# Altium schematic sheet Top.SchDoc
size A4; DocumentNumber: 1; SheetNumber: 1; SheetTotal: 7
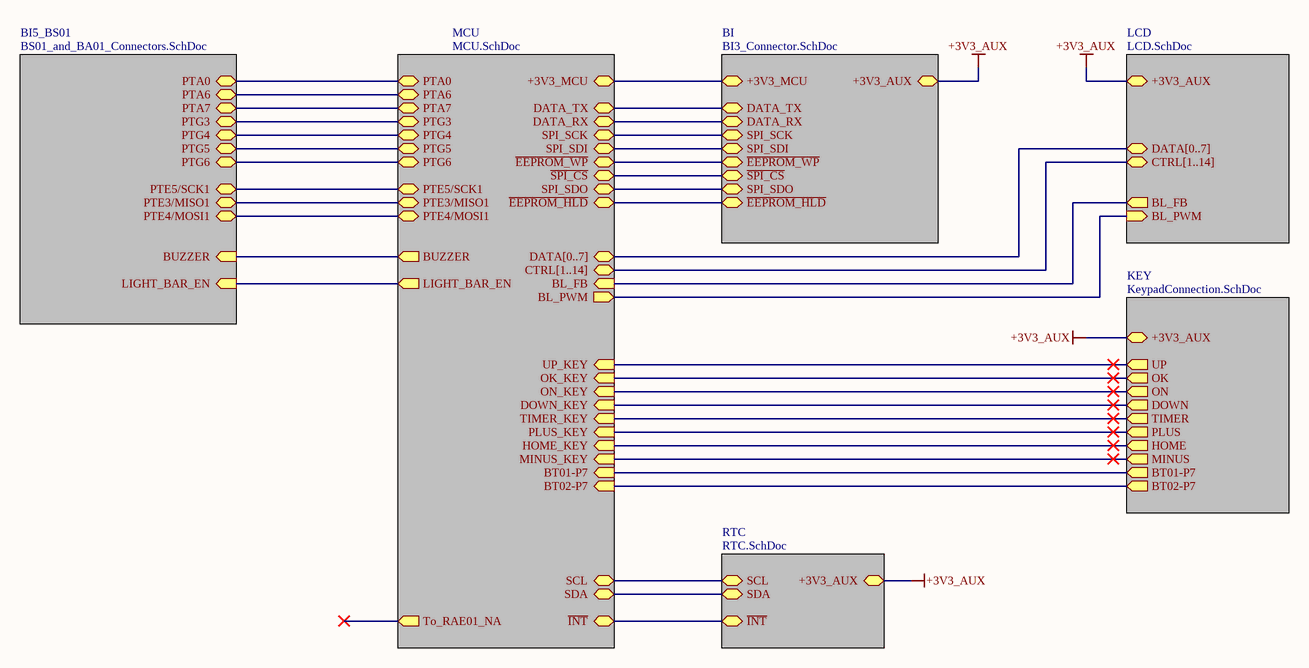
[diagram p0: Top.SchDoc]

## Sub-sheets
BI = BI3_Connector.SchDoc: DATA_TX, +3V3_MCU, +3V3_AUX, DATA_RX, SPI_SCK, SPI_SDI, ~{EEPROM_WP}, ~{SPI_CS}, SPI_SDO, ~{EEPROM_HLD}
BI5_BS01 = BS01_and_BA01_Connectors.SchDoc: PTA6 (bidir), PTA7 (bidir), PTG3 (bidir), PTG4 (bidir), PTG5 (bidir), PTG6 (bidir), PTE5/SCK1 (bidir), PTE3/MISO1 (bidir), PTE4/MOSI1 (bidir), PTA0 (bidir), LIGHT_BAR_EN (in), BUZZER (in)
KEY = KeypadConnection.SchDoc: UP (out), OK (out), ON (out), +3V3_AUX, DOWN (out), TIMER (out), PLUS (out), HOME (out), MINUS (out), BT02-P7 (out), BT01-P7 (out)
LCD = LCD.SchDoc: +3V3_AUX, BL_FB (out), BL_PWM (in), CTRL[1..14], DATA[0..7]
MCU = MCU.SchDoc: DATA_TX, DATA_RX, SPI_SCK, SPI_SDI, ~{EEPROM_WP}, ~{SPI_CS}, SPI_SDO, +3V3_MCU, UP_KEY (in), OK_KEY (in), ON_KEY (in), DOWN_KEY (in), TIMER_KEY (in), PLUS_KEY (in), HOME_KEY (in), MINUS_KEY (in), ~{EEPROM_HLD}, SCL, SDA, ~{INT}, BL_PWM (out), BL_FB (in), BT01-P7 (in), BT02-P7 (in), CTRL[1..14], DATA[0..7], LIGHT_BAR_EN (out), BUZZER (out), To_RAE01_NA (out), PTA6 (bidir), PTA7 (bidir), PTG3 (bidir), PTG4 (bidir), PTG5 (bidir), PTG6 (bidir), PTE5/SCK1 (bidir), PTE3/MISO1 (bidir), PTE4/MOSI1 (bidir), PTA0 (bidir)
RTC = RTC.SchDoc: +3V3_AUX, SCL, SDA, ~{INT}

## Nets
+3V3_AUX: sheet BI/+3V3_AUX, sheet LCD/+3V3_AUX, sheet KEY/+3V3_AUX, sheet RTC/+3V3_AUX
(unnamed): sheet MCU/DATA_TX, sheet BI/DATA_TX
(unnamed): sheet MCU/DATA_RX, sheet BI/DATA_RX
(unnamed): sheet MCU/SPI_SCK, sheet BI/SPI_SCK
(unnamed): sheet MCU/SPI_SDI, sheet BI/SPI_SDI
(unnamed): sheet MCU/~{EEPROM_WP}, sheet BI/~{EEPROM_WP}
(unnamed): sheet MCU/~{SPI_CS}, sheet BI/~{SPI_CS}
(unnamed): sheet MCU/SPI_SDO, sheet BI/SPI_SDO
(unnamed): sheet MCU/+3V3_MCU, sheet BI/+3V3_MCU
(unnamed): sheet MCU/UP_KEY, sheet KEY/UP
(unnamed): sheet MCU/OK_KEY, sheet KEY/OK
(unnamed): sheet MCU/ON_KEY, sheet KEY/ON
(unnamed): sheet MCU/DOWN_KEY, sheet KEY/DOWN
(unnamed): sheet MCU/TIMER_KEY, sheet KEY/TIMER
(unnamed): sheet MCU/PLUS_KEY, sheet KEY/PLUS
(unnamed): sheet MCU/HOME_KEY, sheet KEY/HOME
(unnamed): sheet MCU/MINUS_KEY, sheet KEY/MINUS
(unnamed): sheet MCU/~{EEPROM_HLD}, sheet BI/~{EEPROM_HLD}
(unnamed): sheet MCU/SCL, sheet RTC/SCL
(unnamed): sheet MCU/SDA, sheet RTC/SDA
(unnamed): sheet MCU/~{INT}, sheet RTC/~{INT}
(unnamed): sheet MCU/BL_PWM, sheet LCD/BL_PWM
(unnamed): sheet MCU/BL_FB, sheet LCD/BL_FB
(unnamed): sheet MCU/BT01-P7, sheet KEY/BT01-P7
(unnamed): sheet MCU/BT02-P7, sheet KEY/BT02-P7
(unnamed): sheet MCU/LIGHT_BAR_EN, sheet BI5_BS01/LIGHT_BAR_EN
(unnamed): sheet MCU/BUZZER, sheet BI5_BS01/BUZZER
(unnamed): sheet MCU/PTA6, sheet BI5_BS01/PTA6
(unnamed): sheet MCU/PTA7, sheet BI5_BS01/PTA7
(unnamed): sheet MCU/PTG3, sheet BI5_BS01/PTG3
(unnamed): sheet MCU/PTG4, sheet BI5_BS01/PTG4
(unnamed): sheet MCU/PTG5, sheet BI5_BS01/PTG5
(unnamed): sheet MCU/PTG6, sheet BI5_BS01/PTG6
(unnamed): sheet MCU/PTE5/SCK1, sheet BI5_BS01/PTE5/SCK1
(unnamed): sheet MCU/PTE3/MISO1, sheet BI5_BS01/PTE3/MISO1
(unnamed): sheet MCU/PTE4/MOSI1, sheet BI5_BS01/PTE4/MOSI1
(unnamed): sheet MCU/PTA0, sheet BI5_BS01/PTA0

## Buses and harness runs
bus sheet LCD/CTRL[1..14] = sheet MCU/CTRL[1..14]
bus sheet LCD/DATA[0..7] = sheet MCU/DATA[0..7]

## Notes on the sheet
- Title
- Size:
- Date:
- A4
- Number:
- Time:
- Revision:
- Sheet
- of
- File: